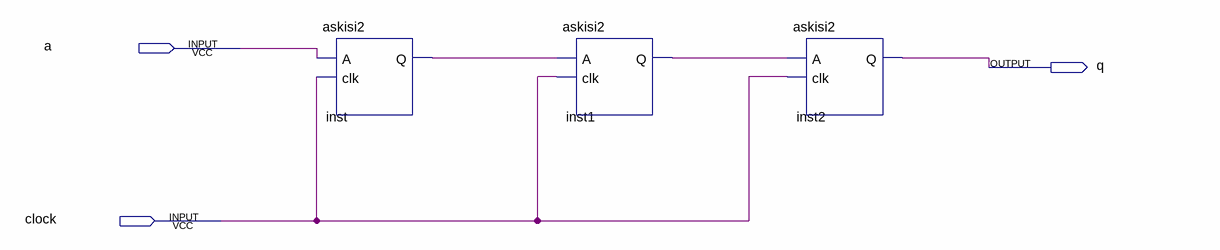
[diagram p0: schematic sheet]
// Quartus schematic Block2.bdf as structural Verilog: 3 symbols, 3 pins
module Block2 (
  input  a,
  input  clock,
  output q
);

  wire inst1_q, inst_q;

  askisi2 inst (.A(a), .clk(clock), .Q(inst_q));
  askisi2 inst1 (.A(inst_q), .clk(clock), .Q(inst1_q));
  askisi2 inst2 (.A(inst1_q), .clk(clock), .Q(q));
endmodule
